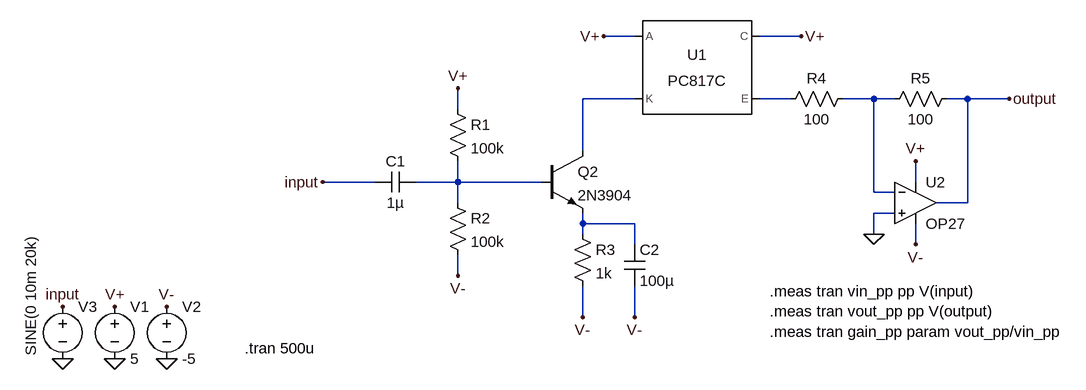
[diagram p0: schematic task1.asc]
task1.asc, the LTspice schematic file:
Version 4
SHEET 1 1920 680
WIRE 656 -624 608 -624
WIRE 912 -624 848 -624
WIRE 656 -528 576 -528
WIRE 896 -528 848 -528
WIRE 1024 -528 976 -528
WIRE 1056 -528 1024 -528
WIRE 1168 -528 1136 -528
WIRE 1232 -528 1168 -528
WIRE 384 -512 384 -544
WIRE 576 -448 576 -528
WIRE 256 -400 176 -400
WIRE 384 -400 384 -432
WIRE 384 -400 320 -400
WIRE 512 -400 384 -400
WIRE 1088 -400 1088 -432
WIRE 1024 -384 1024 -528
WIRE 1056 -384 1024 -384
WIRE 384 -368 384 -400
WIRE 1168 -368 1168 -528
WIRE 1168 -368 1120 -368
WIRE 1056 -352 1024 -352
WIRE 576 -336 576 -352
WIRE 656 -336 576 -336
WIRE 576 -320 576 -336
WIRE 1024 -320 1024 -352
WIRE 656 -304 656 -336
WIRE 1088 -304 1088 -336
WIRE 384 -256 384 -288
WIRE 576 -192 576 -240
WIRE 656 -192 656 -240
FLAG -224 -208 input
FLAG -64 -128 0
FLAG -144 -128 0
FLAG -224 -128 0
FLAG -144 -208 V+
FLAG -64 -208 V-
FLAG 384 -544 V+
FLAG 176 -400 input
FLAG 384 -256 V-
FLAG 656 -192 V-
FLAG 576 -192 V-
FLAG 608 -624 V+
FLAG 912 -624 V+
FLAG 1088 -432 V+
FLAG 1088 -304 V-
FLAG 1024 -320 0
FLAG 1232 -528 output
SYMBOL voltage -144 -224 R0
WINDOW 123 0 0 Left 0
WINDOW 39 0 0 Left 0
SYMATTR InstName V1
SYMATTR Value 5
SYMBOL voltage -64 -224 R0
WINDOW 123 0 0 Left 0
WINDOW 39 0 0 Left 0
SYMATTR InstName V2
SYMATTR Value -5
SYMBOL npn 512 -448 R0
SYMATTR InstName Q2
SYMATTR Value 2N3904
SYMBOL voltage -224 -224 R0
WINDOW 3 -49 -93 VRight 2
WINDOW 123 0 0 Left 0
WINDOW 39 0 0 Left 0
SYMATTR InstName V3
SYMATTR Value SINE(0 10m 20k)
SYMBOL res 368 -528 R0
SYMATTR InstName R1
SYMATTR Value 100k
SYMBOL res 368 -384 R0
SYMATTR InstName R2
SYMATTR Value 100k
SYMBOL cap 320 -416 R90
WINDOW 0 0 32 VBottom 2
WINDOW 3 32 32 VTop 2
SYMATTR InstName C1
SYMATTR Value 1µ
SYMBOL res 560 -336 R0
SYMATTR InstName R3
SYMATTR Value 1k
SYMBOL cap 640 -304 R0
SYMATTR InstName C2
SYMATTR Value 100µ
SYMBOL Optos\\PC817C 752 -576 R0
SYMATTR InstName U1
SYMBOL res 992 -544 R90
WINDOW 0 0 56 VBottom 2
WINDOW 3 32 56 VTop 2
SYMATTR InstName R4
SYMATTR Value 100
SYMBOL res 1152 -544 R90
WINDOW 0 0 56 VBottom 2
WINDOW 3 32 56 VTop 2
SYMATTR InstName R5
SYMATTR Value 100
SYMBOL OpAmps\\OP27 1088 -432 R0
SYMATTR InstName U2
TEXT 56 -144 Left 2 !.tran 500u
TEXT 864 -232 Left 2 !.meas tran vin_pp pp V(input)\n.meas tran vout_pp pp V(output)\n.meas tran gain_pp param vout_pp/vin_pp

The netlist it stands for:
* task1.asc
V1 V+ 0 5
V2 V- 0 -5
Q2 N001 N004 N005 0 2N3904
V3 input 0 SINE(0 10m 20k)
R1 V+ N004 100k
R2 N004 V- 100k
C1 N004 input 1µ
R3 N005 V- 1k
C2 N005 V- 100µ
XU1 V+ N001 V+ N002 PC817 Igain=2.3m  ; PC817C, pins A K C E
R4 N003 N002 100
R5 output N003 100
XU2 0 N003 V+ V- output OP27  ; pins In+ In- V+ V- OUT
.model NPN NPN
.model PNP PNP
.lib standard.bjt
.tran 500u
.meas tran vin_pp pp V(input)
.meas tran vout_pp pp V(output)
.meas tran gain_pp param vout_pp/vin_pp
.lib PC817.sub
.lib ADI.lib
.backanno
.end

* Results of the author's LTspice run, read from the files saved beside the schematic
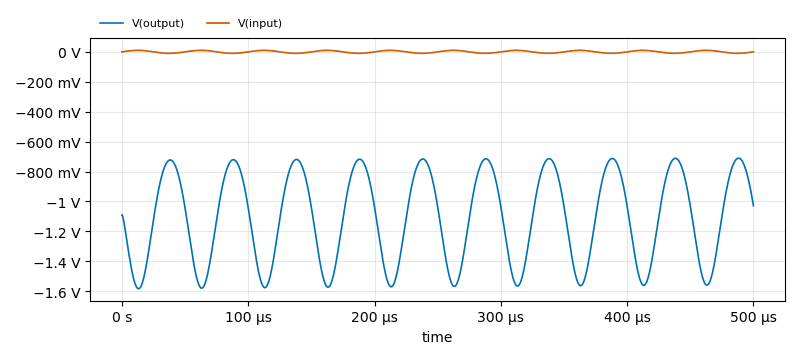
[diagram p1: Transient Analysis of task1.asc, plotted from the saved traces]
* Transient Analysis, 1 run:
*   V(output): min -1.584 V, max -710.8 mV, average -1.109 V, rms 1.149 V, last -1.029 V
*   V(input): min -10 mV, max 10 mV, average -1.04 µV, rms 7.07 mV, last 0 V